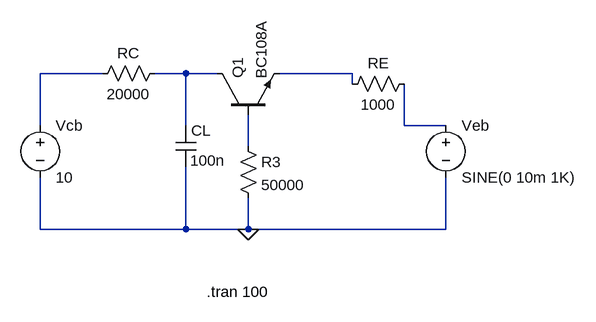
[diagram p0: schematic Draft1.asc]
Draft1.asc, the LTspice schematic file:
Version 4
SHEET 1 1004 680
WIRE 256 0 160 0
WIRE 384 0 336 0
WIRE 432 0 384 0
WIRE 640 0 528 0
WIRE 640 16 640 0
WIRE 160 80 160 0
WIRE 384 80 384 0
WIRE 720 80 720 16
WIRE 784 80 720 80
WIRE 480 112 480 64
WIRE 160 240 160 160
WIRE 384 240 384 144
WIRE 384 240 160 240
WIRE 480 240 480 192
WIRE 480 240 384 240
WIRE 784 240 784 160
WIRE 784 240 480 240
FLAG 480 240 0
DATAFLAG 384 0 ""
DATAFLAG 640 0 ""
DATAFLAG 480 96 ""
SYMBOL voltage 160 64 R0
SYMATTR InstName Vcb
SYMATTR Value 10
SYMBOL voltage 784 64 R0
WINDOW 123 24 124 Left 2
WINDOW 39 0 0 Left 0
SYMATTR InstName Veb
SYMATTR Value SINE(0 10m 1K)
SYMBOL res 464 96 R0
SYMATTR InstName R3
SYMATTR Value 50000
SYMBOL res 736 0 R90
WINDOW 0 0 56 VBottom 2
WINDOW 3 32 56 VTop 2
SYMATTR InstName RE
SYMATTR Value 1000
SYMBOL res 352 -16 R90
WINDOW 0 0 56 VBottom 2
WINDOW 3 32 56 VTop 2
SYMATTR InstName RC
SYMATTR Value 20000
SYMBOL cap 368 80 R0
WINDOW 3 23 54 Left 2
SYMATTR InstName CL
SYMATTR Value 100n
SYMBOL npn 432 64 R270
SYMATTR InstName Q1
SYMATTR Value BC108A
TEXT 416 336 Left 2 !.tran 100

The netlist it stands for:
* Draft1.asc
Vcb N001 0 10
Veb N004 0 SINE(0 10m 1K)
R3 N005 0 50000
RE N004 N003 1000
RC N002 N001 20000
CL N002 0 100n
Q1 N002 N005 N003 0 BC108A
.model NPN NPN
.model PNP PNP
.lib standard.bjt
.tran 100
.backanno
.end